# Altium schematic sheet Preamplifier_switch.SchDoc
size A3; Organization: Altium Limited; Address1: L3, 12a Rodborough Rd; Address2: Frenchs Forest; Address3: NSW; Address4: Australia 2086
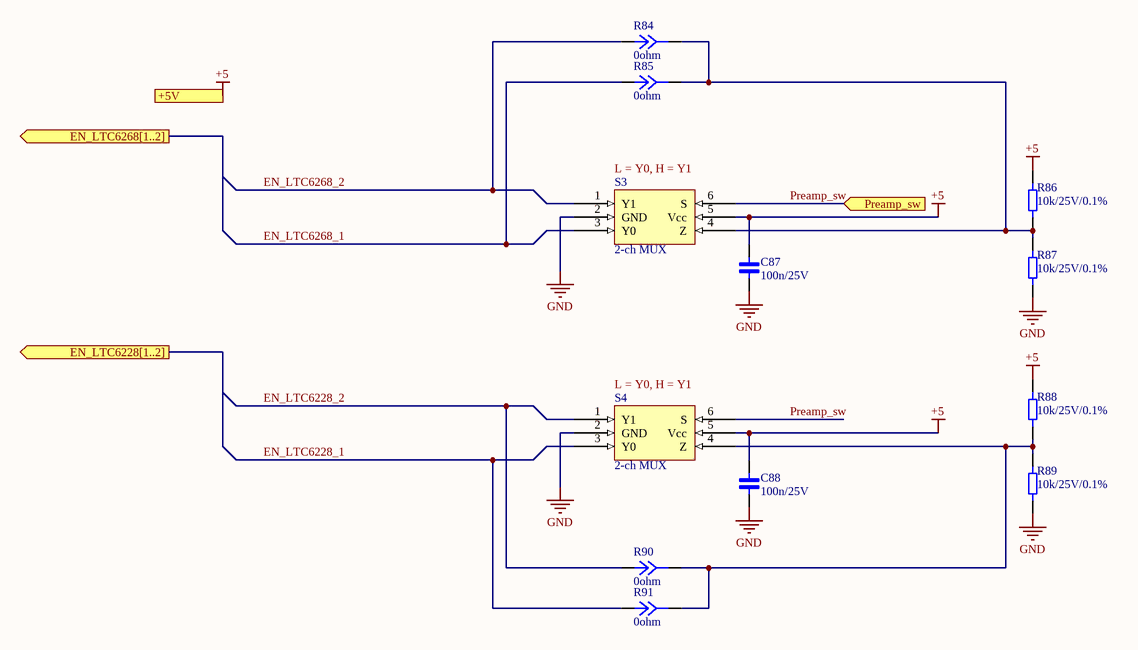
[diagram p0: Preamplifier_switch.SchDoc]

## Parts
C87  100n/25V  [CAP_0603]
C88  100n/25V  [CAP_0603]
R84  0ohm  [Jumper]
R85  0ohm  [Jumper]
R86  10k/25V/0.1%  [RES_0603]
R87  10k/25V/0.1%  [RES_0603]
R88  10k/25V/0.1%  [RES_0603]
R89  10k/25V/0.1%  [RES_0603]
R90  0ohm  [Jumper]
R91  0ohm  [Jumper]
S3  2-ch MUX  [TSOP6]
S4  2-ch MUX  [TSOP6]

## Ports
+5V (in), EN_LTC6228[1..2] (out), EN_LTC6268[1..2] (out), Preamp_sw (in)

## Nets
+5: C87.2 C88.2 R86.2 R88.2 S3.5(Vcc) S4.5(Vcc) ; port +5V
GND: C87.1 C88.1 R87.2 R89.2 S3.2(GND) S4.2(GND)
EN_LTC6228_1: R91.2 S4.3(Y0)
EN_LTC6228_2: R90.2 S4.1(Y1)
EN_LTC6268_1: R85.2 S3.3(Y0)
EN_LTC6268_2: R84.2 S3.1(Y1)
Preamp_sw: S3.6(S) S4.6(S) ; port Preamp_sw
NetR84_2: R84.2 R85.2 R86.2 R87.2 S3.4(Z)
NetR88_2: R88.2 R89.2 R90.2 R91.2 S4.4(Z)

## Notes on the sheet
- (near S3) L = Y0, H = Y1
- (near S4) L = Y0, H = Y1
- Title
- Size:
- Date:
- A3
- Number:
- Time:
- Revision:
- Sheet
- of
- File:

## Library data of the parts
C87 C88 = Cap_0603_100n: Ceramic Capacitor 100n / 0603 / 25V / ±5%, Wurth Elektronik MLCC; ComponentLink1Description: New link; ComponentLink1URL: https://www.we-online.com/catalog/en/WCAP-CSGP-25VDC
R84 R85 R90 R91 = Jumper
R86-R89 = Res_0603_10k: Vishay, thin film resistor 10k/25V/0.1%
S3 S4 = 74LVC1G3157-Q100: 2-channel analog multiplexer/demultiplexernexperia